# Altium schematic sheet esp32.SchDoc
size A4; SheetNumber: 3; SheetTotal: 4
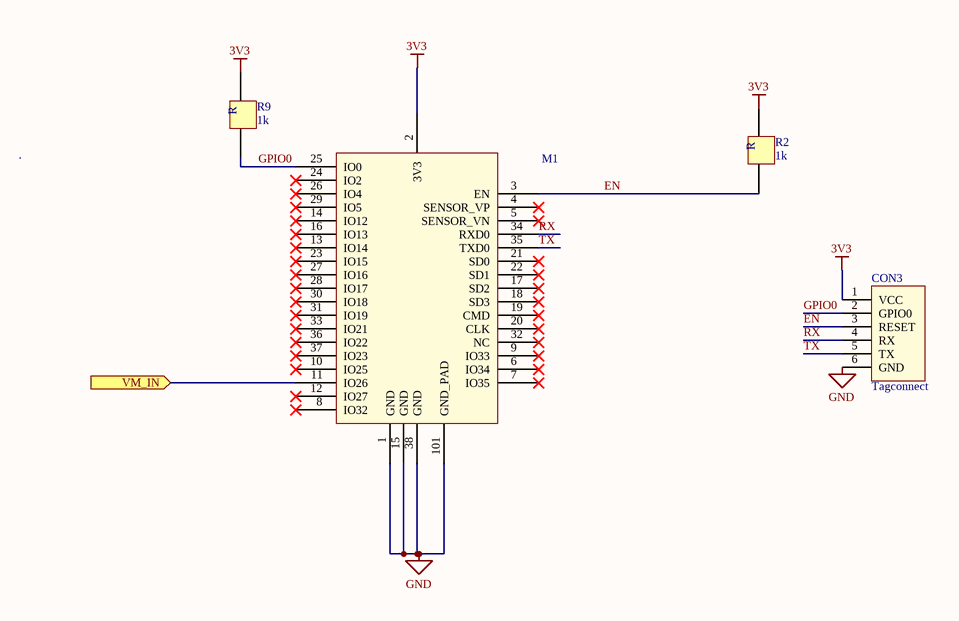
[diagram p0: esp32.SchDoc]

## Parts
CON3  Tagconnect  [Tagconnect]
M1  ESP32S_Module  [ESP32S_W]  (value not drawn)
R2  1k  [0603]
R9  1k  [0603]

## Ports
VM_IN (in)

## Nets
3V3: CON3.1(VCC) M1.2(3V3) R2.1 R9.1
GND: CON3.6(GND) M1.1(GND) M1.15(GND) M1.38(GND) M1.101(GND_PAD)
EN: CON3.3(RESET) M1.3(EN) R2.2
GPIO0: CON3.2(GPIO0) M1.25(IO0) R9.2
RX: CON3.4(RX) M1.34(RXD0)
TX: CON3.5(TX) M1.35(TXD0)
VM_IN: M1.11(IO26) ; port VM_IN

Not connected (* = marked no-connect by the designer): M1 4(SENSOR_VP)* 5(SENSOR_VN)* 6(IO34)* 7(IO35)* 8(IO32)* 9(IO33)* 10(IO25)* 12(IO27)* 13(IO14)* 14(IO12)* 16(IO13)* 17(SD2)* 18(SD3)* 19(CMD)* 20(CLK)* 21(SD0)* 22(SD1)* 23(IO15)* 24(IO2)* 26(IO4)* 27(IO16)* 28(IO17)* 29(IO5)* 30(IO18)* 31(IO19)* 32(NC)* 33(IO21)* 36(IO22)* 37(IO23)*

## Notes on the sheet
- (in symbol resistor) R

## Library data of the parts
M1 = ESP32S_Module: Esp-32S; Datasheet: https://espressif.com/sites/default/files/documentation/esp_wroom_32_datasheet_en.pdf
R2 R9 = resistor